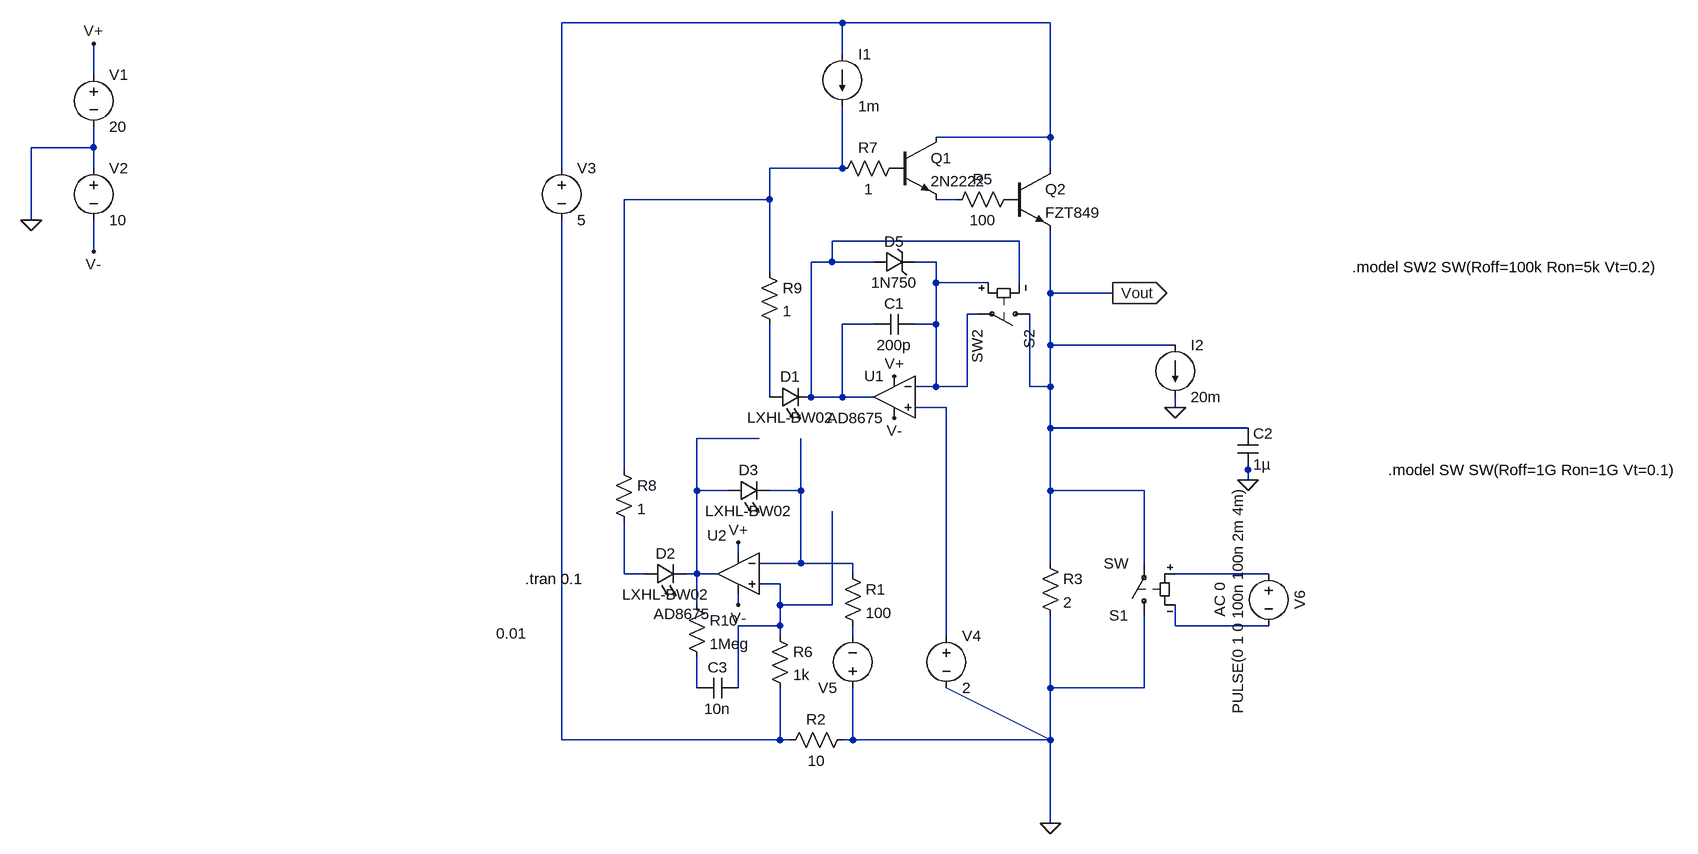
[diagram p0: schematic my_design_from_scratch.asc]
my_design_from_scratch.asc, the LTspice schematic file:
Version 4
SHEET 1 1588 1284
WIRE 256 32 -176 32
WIRE 576 32 256 32
WIRE 256 80 256 32
WIRE -896 112 -896 64
WIRE 576 208 576 32
WIRE 576 208 400 208
WIRE -896 224 -896 192
WIRE -896 224 -992 224
WIRE -896 256 -896 224
WIRE -176 256 -176 32
WIRE 256 256 256 160
WIRE 256 256 144 256
WIRE 576 256 576 208
WIRE 144 304 144 256
WIRE 144 304 -80 304
WIRE 432 304 400 304
WIRE -992 336 -992 224
WIRE 528 368 240 368
WIRE -896 384 -896 336
WIRE 240 400 240 368
WIRE 240 400 208 400
WIRE 304 400 240 400
WIRE 400 400 368 400
WIRE 144 416 144 304
WIRE 400 432 400 400
WIRE 480 432 400 432
WIRE 528 432 528 368
WIRE 576 448 576 352
WIRE 672 448 576 448
WIRE 464 480 448 480
WIRE 304 496 256 496
WIRE 400 496 400 432
WIRE 400 496 368 496
WIRE 576 528 576 448
WIRE 768 528 576 528
WIRE 400 592 400 496
WIRE 400 592 368 592
WIRE 448 592 448 480
WIRE 448 592 400 592
WIRE 544 592 544 480
WIRE 576 592 576 528
WIRE 576 592 544 592
WIRE 144 608 144 496
WIRE 208 608 208 400
WIRE 256 608 256 496
WIRE 256 608 208 608
WIRE 304 608 256 608
WIRE 416 624 368 624
WIRE 768 624 768 608
WIRE 576 656 576 592
WIRE 880 656 576 656
WIRE 128 672 32 672
WIRE -80 720 -80 304
WIRE 880 720 880 704
WIRE 880 736 880 720
WIRE 32 752 32 672
WIRE 80 752 32 752
WIRE 192 752 192 672
WIRE 192 752 144 752
WIRE 576 752 576 656
WIRE 720 752 576 752
WIRE 96 848 96 832
WIRE 192 864 192 752
WIRE 192 864 128 864
WIRE 272 864 192 864
WIRE 576 864 576 752
WIRE 720 864 720 752
WIRE -80 880 -80 800
WIRE -48 880 -80 880
WIRE 32 880 32 752
WIRE 32 880 16 880
WIRE 64 880 32 880
WIRE 272 880 272 864
WIRE 912 880 768 880
WIRE 160 896 128 896
WIRE 32 928 32 880
WIRE 96 928 96 912
WIRE 160 928 160 896
WIRE 240 928 240 784
WIRE 240 928 160 928
WIRE 160 960 160 928
WIRE 160 960 96 960
WIRE 768 960 768 928
WIRE 912 960 768 960
WIRE 160 976 160 960
WIRE 272 976 272 960
WIRE 416 976 416 624
WIRE 32 1056 32 1008
WIRE 96 1056 96 960
WIRE 576 1056 576 944
WIRE 720 1056 720 944
WIRE 720 1056 576 1056
WIRE -176 1136 -176 336
WIRE 160 1136 160 1056
WIRE 160 1136 -176 1136
WIRE 176 1136 160 1136
WIRE 272 1136 272 1056
WIRE 272 1136 256 1136
WIRE 576 1136 416 1056
WIRE 576 1136 576 1056
WIRE 576 1136 272 1136
WIRE 576 1264 576 1136
FLAG -896 64 V+
FLAG -896 384 V-
FLAG 336 576 V+
FLAG 336 640 V-
FLAG 672 448 Vout
IOPIN 672 448 Out
FLAG 576 1264 0
FLAG -992 336 0
FLAG 96 832 V+
FLAG 96 928 V-
FLAG 880 736 0
FLAG 768 624 0
SYMBOL voltage -896 96 R0
WINDOW 123 0 0 Left 0
WINDOW 39 0 0 Left 0
SYMATTR InstName V1
SYMATTR Value 20
SYMBOL voltage -896 240 R0
WINDOW 123 0 0 Left 0
WINDOW 39 0 0 Left 0
SYMATTR InstName V2
SYMATTR Value 10
SYMBOL voltage -176 240 R0
WINDOW 123 0 0 Left 0
WINDOW 39 0 0 Left 0
SYMATTR InstName V3
SYMATTR Value 5
SYMBOL res 272 1120 R90
WINDOW 0 0 56 VBottom 2
WINDOW 3 32 56 VTop 2
SYMATTR InstName R2
SYMATTR Value 10
SYMBOL Opamps\\AD8675 336 544 M0
SYMATTR InstName U1
SYMBOL voltage 416 960 R0
WINDOW 123 0 0 Left 0
WINDOW 39 0 0 Left 0
SYMATTR InstName V4
SYMATTR Value 2
SYMBOL npn 512 256 R0
SYMATTR InstName Q2
SYMATTR Value FZT849
SYMBOL cap 368 480 R90
WINDOW 0 0 32 VBottom 2
WINDOW 3 32 32 VTop 2
SYMATTR InstName C1
SYMATTR Value 200p
SYMBOL Opamps\\AD8675 96 816 M0
WINDOW 0 17 5 Left 2
WINDOW 3 43 126 Left 2
SYMATTR InstName U2
SYMBOL LED -48 896 R270
WINDOW 0 32 32 VTop 2
WINDOW 3 0 32 VBottom 2
SYMATTR InstName D2
SYMATTR Value LXHL-BW02
SYMATTR Description Diode
SYMATTR Type diode
SYMBOL voltage 272 1072 R180
WINDOW 123 0 0 Left 0
WINDOW 39 0 0 Left 0
WINDOW 3 501 100 Left 2
SYMATTR Value 0.01
SYMATTR InstName V5
SYMBOL res 560 848 R0
SYMATTR InstName R3
SYMATTR Value 2
SYMBOL sw 720 960 R180
SYMATTR InstName S1
SYMBOL voltage 912 864 R0
WINDOW 0 32 56 VTop 2
WINDOW 3 -32 56 VBottom 2
WINDOW 123 -60 56 VBottom 2
WINDOW 39 0 0 Left 0
SYMATTR InstName V6
SYMATTR Value PULSE(0 1 0 100n 100n 2m 4m)
SYMATTR Value2 AC 0
SYMBOL res 256 864 R0
SYMATTR InstName R1
SYMATTR Value 100
SYMBOL cap 864 656 R0
SYMATTR InstName C2
SYMATTR Value 1µ
SYMBOL npn 336 208 R0
SYMATTR InstName Q1
SYMATTR Value 2N2222
SYMBOL current 256 80 R0
WINDOW 123 0 0 Left 0
WINDOW 39 0 0 Left 0
SYMATTR InstName I1
SYMATTR Value 1m
SYMBOL LED 144 624 R270
WINDOW 0 32 32 VTop 2
WINDOW 3 0 32 VBottom 2
SYMATTR InstName D1
SYMATTR Value LXHL-BW02
SYMATTR Description Diode
SYMATTR Type diode
SYMBOL current 768 528 R0
WINDOW 123 0 0 Left 0
WINDOW 39 0 0 Left 0
SYMATTR InstName I2
SYMATTR Value 20m
SYMBOL res 528 288 R90
WINDOW 0 0 56 VBottom 2
WINDOW 3 32 56 VTop 2
SYMATTR InstName R5
SYMATTR Value 100
SYMBOL res 144 960 R0
SYMATTR InstName R6
SYMATTR Value 1k
SYMBOL res 352 240 R90
WINDOW 0 0 56 VBottom 2
WINDOW 3 32 56 VTop 2
SYMATTR InstName R7
SYMATTR Value 1
SYMBOL res -96 704 R0
SYMATTR InstName R8
SYMATTR Value 1
SYMBOL res 128 400 R0
SYMATTR InstName R9
SYMATTR Value 1
SYMBOL res 16 912 R0
SYMATTR InstName R10
SYMATTR Value 1Meg
SYMBOL cap 96 1040 R90
WINDOW 0 0 32 VBottom 2
WINDOW 3 32 32 VTop 2
SYMATTR InstName C3
SYMATTR Value 10n
SYMBOL LED 80 768 R270
WINDOW 0 32 32 VTop 2
WINDOW 3 0 32 VBottom 2
SYMATTR InstName D3
SYMATTR Value LXHL-BW02
SYMATTR Description Diode
SYMATTR Type diode
SYMBOL zener 304 416 R270
WINDOW 0 32 32 VTop 2
WINDOW 3 0 32 VBottom 2
SYMATTR InstName D5
SYMATTR Value 1N750
SYMATTR Description Diode
SYMATTR Type diode
SYMBOL sw 560 480 R90
SYMATTR InstName S2
SYMATTR Value SW2
TEXT -232 888 Left 2 !.tran 0.1
TEXT 1096 720 Left 2 !.model SW SW(Roff=1G Ron=1G Vt=0.1)
TEXT 1040 408 Left 2 !.model SW2 SW(Roff=100k Ron=5k Vt=0.2)

The netlist it stands for:
* my_design_from_scratch.asc
V1 V+ 0 20
V2 0 V- 10
V3 N001 N016 5
R2 0 N016 10
XU1 N007 N005 V+ V- N004 AD8675  ; pins In+ In- V+ V- OUT
V4 N007 0 2
Q2 N001 P001 Vout 0 FZT849
C1 N005 N004 200p
XU2 N012 N009 V+ V- N008 AD8675  ; pins In+ In- V+ V- OUT
D2 N010 N008 LXHL-BW02
V5 0 N014 0.01
R3 Vout 0 2
S1 0 Vout N011 N013 SW
V6 N011 N013 PULSE(0 1 0 100n 100n 2m 4m) AC 0
R1 N009 N014 100
C2 Vout 0 1µ
Q1 N001 P002 N003 0 2N2222
I1 N001 N002 1m
D1 N006 N004 LXHL-BW02
I2 Vout 0 20m
R5 P001 N003 100
R6 N012 N016 1k
R7 P002 N002 1
R8 N002 N010 1
R9 N002 N006 1
R10 N008 N015 1Meg
C3 N012 N015 10n
D3 N008 N009 LXHL-BW02
D5 N004 N005 1N750
S2 Vout N005 N005 N004 SW2
.model D D
.lib standard.dio
.model NPN NPN
.model PNP PNP
.lib standard.bjt
.tran 0.1
.model SW SW(Roff=1G Ron=1G Vt=0.1)
.model SW2 SW(Roff=100k Ron=5k Vt=0.2)
.backanno
.end